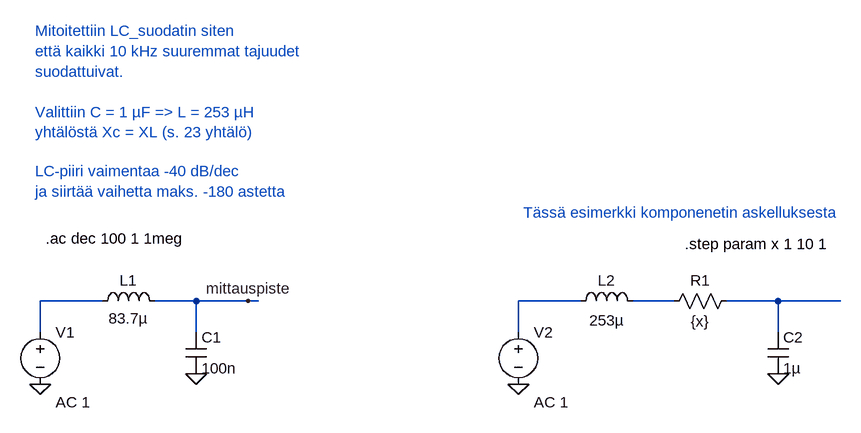
[diagram p0: schematic HT_teht3.asc]
HT_teht3.asc, the LTspice schematic file:
Version 4
SHEET 1 1044 680
WIRE -192 368 -288 368
WIRE -48 368 -112 368
WIRE 32 368 -48 368
WIRE 48 368 32 368
WIRE 544 368 448 368
WIRE 688 368 624 368
WIRE 848 368 768 368
WIRE 944 368 848 368
WIRE -288 416 -288 368
WIRE -48 416 -48 368
WIRE 448 416 448 368
WIRE 848 416 848 368
FLAG -288 496 0
FLAG -48 480 0
FLAG 448 496 0
FLAG 848 480 0
FLAG 32 368 mittauspiste
SYMBOL voltage -288 400 R0
WINDOW 123 24 124 Left 2
WINDOW 39 0 0 Left 2
SYMATTR Value2 AC 1
SYMATTR InstName V1
SYMATTR Value ""
SYMBOL ind -208 384 R270
WINDOW 0 32 56 VTop 2
WINDOW 3 5 56 VBottom 2
SYMATTR InstName L1
SYMATTR Value 83.7µ
SYMBOL cap -64 416 R0
SYMATTR InstName C1
SYMATTR Value 100n
SYMBOL voltage 448 400 R0
WINDOW 123 24 124 Left 2
WINDOW 39 0 0 Left 2
SYMATTR Value2 AC 1
SYMATTR InstName V2
SYMATTR Value ""
SYMBOL ind 528 384 R270
WINDOW 0 32 56 VTop 2
WINDOW 3 2 56 VBottom 2
SYMATTR InstName L2
SYMATTR Value 253µ
SYMBOL cap 832 416 R0
SYMATTR InstName C2
SYMATTR Value 1µ
SYMBOL res 784 352 R90
WINDOW 0 0 56 VBottom 2
WINDOW 3 32 56 VTop 2
SYMATTR InstName R1
SYMATTR Value {x}
TEXT -280 272 Left 2 !.ac dec 100 1 1meg
TEXT -296 -48 Left 2 ;Mitoitettiin LC_suodatin siten\nettä kaikki 10 kHz suuremmat tajuudet\nsuodattuivat.\n \nValittiin C = 1 µF => L = 253 µH\nyhtälöstä Xc = XL (s. 23 yhtälö)
TEXT -296 168 Left 2 ;LC-piiri vaimentaa -40 dB/dec\nja siirtää vaihetta maks. -180 astetta
TEXT 704 280 Left 2 !.step param x 1 10 1
TEXT 456 232 Left 2 ;Tässä esimerkki komponenetin askelluksesta

The netlist it stands for:
* HT_teht3.asc
V1 N001 0 AC 1
L1 N001 mittauspiste 83.7µ
C1 mittauspiste 0 100n
V2 N002 0 AC 1
L2 N002 N003 253µ
C2 N004 0 1µ
R1 N004 N003 {x}
.ac dec 100 1 1meg
* Mitoitettiin LC_suodatin siten
* että kaikki 10 kHz suuremmat tajuudet
* suodattuivat.
* Valittiin C = 1 µF => L = 253 µH
* yhtälöstä Xc = XL (s. 23 yhtälö)
* LC-piiri vaimentaa -40 dB/dec
* ja siirtää vaihetta maks. -180 astetta
.step param x 1 10 1
* Tässä esimerkki komponenetin askelluksesta
.backanno
.end